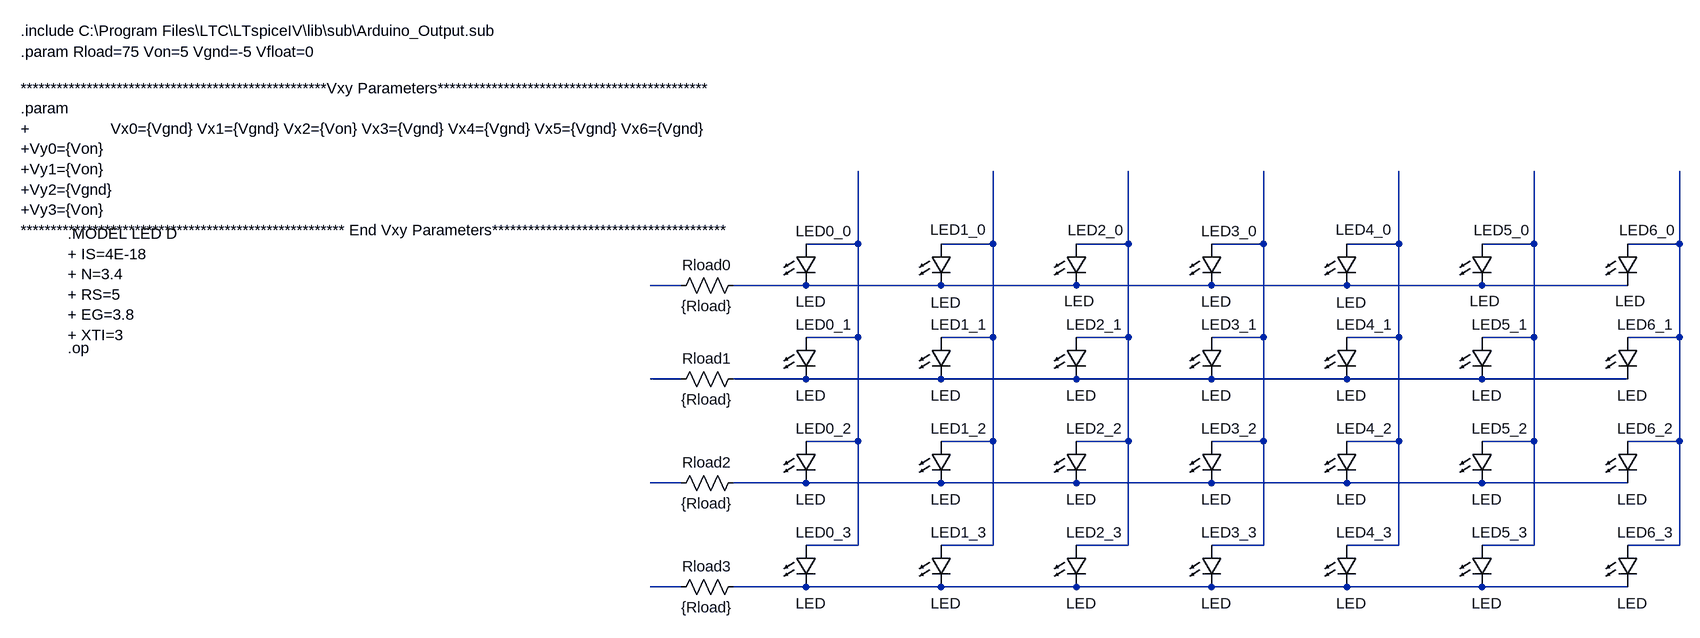
[diagram p0: schematic LED_Array_PCB.asc]
LED_Array_PCB.asc, the LTspice schematic file:
Version 4
SHEET 1 1512 804
WIRE 240 80 240 -32
WIRE 240 80 160 80
WIRE 448 80 448 -32
WIRE 448 80 368 80
WIRE 656 80 656 -32
WIRE 656 80 576 80
WIRE 864 80 864 -32
WIRE 864 80 784 80
WIRE 1072 80 1072 -32
WIRE 1072 80 992 80
WIRE 1280 80 1280 -32
WIRE 1280 80 1200 80
WIRE 1504 80 1504 -32
WIRE 1504 80 1424 80
WIRE -32 144 -80 144
WIRE 160 144 48 144
WIRE 368 144 160 144
WIRE 576 144 368 144
WIRE 784 144 576 144
WIRE 992 144 784 144
WIRE 1200 144 992 144
WIRE 1424 144 1200 144
WIRE 240 224 240 80
WIRE 240 224 160 224
WIRE 448 224 448 80
WIRE 448 224 368 224
WIRE 656 224 656 80
WIRE 656 224 576 224
WIRE 864 224 864 80
WIRE 864 224 784 224
WIRE 1072 224 1072 80
WIRE 1072 224 992 224
WIRE 1280 224 1280 80
WIRE 1280 224 1200 224
WIRE 1504 224 1504 80
WIRE 1504 224 1424 224
WIRE -32 288 -80 288
WIRE 160 288 48 288
WIRE 368 288 160 288
WIRE 576 288 368 288
WIRE 784 288 576 288
WIRE 992 288 784 288
WIRE 1200 288 992 288
WIRE 1424 288 1200 288
WIRE 240 384 240 224
WIRE 240 384 160 384
WIRE 448 384 448 224
WIRE 448 384 368 384
WIRE 656 384 656 224
WIRE 656 384 576 384
WIRE 864 384 864 224
WIRE 864 384 784 384
WIRE 1072 384 1072 224
WIRE 1072 384 992 384
WIRE 1280 384 1280 224
WIRE 1280 384 1200 384
WIRE 1504 384 1504 224
WIRE 1504 384 1424 384
WIRE -32 448 -80 448
WIRE 160 448 48 448
WIRE 368 448 160 448
WIRE 576 448 368 448
WIRE 784 448 576 448
WIRE 992 448 784 448
WIRE 1200 448 992 448
WIRE 1424 448 1200 448
WIRE 240 544 240 384
WIRE 240 544 160 544
WIRE 448 544 448 384
WIRE 448 544 368 544
WIRE 656 544 656 384
WIRE 656 544 576 544
WIRE 864 544 864 384
WIRE 864 544 784 544
WIRE 1072 544 1072 384
WIRE 1072 544 992 544
WIRE 1280 544 1280 384
WIRE 1280 544 1200 544
WIRE 1504 544 1504 384
WIRE 1504 544 1424 544
WIRE -32 608 -80 608
WIRE 160 608 48 608
WIRE 368 608 160 608
WIRE 576 608 368 608
WIRE 784 608 576 608
WIRE 992 608 784 608
WIRE 1200 608 992 608
WIRE 1424 608 1200 608
SYMBOL LED 144 80 R0
WINDOW 0 0 -20 Left 2
WINDOW 3 0 89 Left 2
SYMATTR InstName LED0_0
SYMATTR Value LED
SYMBOL res 64 128 R90
WINDOW 0 0 56 VBottom 2
WINDOW 3 32 56 VTop 2
SYMATTR InstName Rload0
SYMATTR Value {Rload}
SYMBOL res 64 272 R90
WINDOW 0 0 56 VBottom 2
WINDOW 3 32 56 VTop 2
SYMATTR InstName Rload1
SYMATTR Value {Rload}
SYMBOL res 64 432 R90
WINDOW 0 0 56 VBottom 2
WINDOW 3 32 56 VTop 2
SYMATTR InstName Rload2
SYMATTR Value {Rload}
SYMBOL LED 352 80 R0
WINDOW 0 -1 -22 Left 2
WINDOW 3 0 90 Left 2
SYMATTR InstName LED1_0
SYMATTR Value LED
SYMBOL LED 560 80 R0
WINDOW 0 3 -21 Left 2
WINDOW 3 -3 88 Left 2
SYMATTR InstName LED2_0
SYMATTR Value LED
SYMBOL LED 144 224 R0
WINDOW 0 0 -20 Left 2
WINDOW 3 0 89 Left 2
SYMATTR InstName LED0_1
SYMATTR Value LED
SYMBOL LED 352 224 R0
WINDOW 0 0 -20 Left 2
WINDOW 3 0 89 Left 2
SYMATTR InstName LED1_1
SYMATTR Value LED
SYMBOL LED 560 224 R0
WINDOW 0 0 -20 Left 2
WINDOW 3 0 89 Left 2
SYMATTR InstName LED2_1
SYMATTR Value LED
SYMBOL LED 144 384 R0
WINDOW 0 0 -20 Left 2
WINDOW 3 0 89 Left 2
SYMATTR InstName LED0_2
SYMATTR Value LED
SYMBOL LED 352 384 R0
WINDOW 0 0 -20 Left 2
WINDOW 3 0 89 Left 2
SYMATTR InstName LED1_2
SYMATTR Value LED
SYMBOL LED 560 384 R0
WINDOW 0 0 -20 Left 2
WINDOW 3 0 89 Left 2
SYMATTR InstName LED2_2
SYMATTR Value LED
SYMBOL res 64 592 R90
WINDOW 0 0 56 VBottom 2
WINDOW 3 32 56 VTop 2
SYMATTR InstName Rload3
SYMATTR Value {Rload}
SYMBOL LED 144 544 R0
WINDOW 0 0 -20 Left 2
WINDOW 3 0 89 Left 2
SYMATTR InstName LED0_3
SYMATTR Value LED
SYMBOL LED 352 544 R0
WINDOW 0 0 -20 Left 2
WINDOW 3 0 89 Left 2
SYMATTR InstName LED1_3
SYMATTR Value LED
SYMBOL LED 560 544 R0
WINDOW 0 0 -20 Left 2
WINDOW 3 0 89 Left 2
SYMATTR InstName LED2_3
SYMATTR Value LED
SYMBOL LED 768 80 R0
WINDOW 0 0 -20 Left 2
WINDOW 3 0 89 Left 2
SYMATTR InstName LED3_0
SYMATTR Value LED
SYMBOL LED 976 80 R0
WINDOW 0 -1 -22 Left 2
WINDOW 3 0 90 Left 2
SYMATTR InstName LED4_0
SYMATTR Value LED
SYMBOL LED 1184 80 R0
WINDOW 0 3 -21 Left 2
WINDOW 3 -3 88 Left 2
SYMATTR InstName LED5_0
SYMATTR Value LED
SYMBOL LED 768 224 R0
WINDOW 0 0 -20 Left 2
WINDOW 3 0 89 Left 2
SYMATTR InstName LED3_1
SYMATTR Value LED
SYMBOL LED 976 224 R0
WINDOW 0 0 -20 Left 2
WINDOW 3 0 89 Left 2
SYMATTR InstName LED4_1
SYMATTR Value LED
SYMBOL LED 1184 224 R0
WINDOW 0 0 -20 Left 2
WINDOW 3 0 89 Left 2
SYMATTR InstName LED5_1
SYMATTR Value LED
SYMBOL LED 768 384 R0
WINDOW 0 0 -20 Left 2
WINDOW 3 0 89 Left 2
SYMATTR InstName LED3_2
SYMATTR Value LED
SYMBOL LED 976 384 R0
WINDOW 0 0 -20 Left 2
WINDOW 3 0 89 Left 2
SYMATTR InstName LED4_2
SYMATTR Value LED
SYMBOL LED 1184 384 R0
WINDOW 0 0 -20 Left 2
WINDOW 3 0 89 Left 2
SYMATTR InstName LED5_2
SYMATTR Value LED
SYMBOL LED 768 544 R0
WINDOW 0 0 -20 Left 2
WINDOW 3 0 89 Left 2
SYMATTR InstName LED3_3
SYMATTR Value LED
SYMBOL LED 976 544 R0
WINDOW 0 0 -20 Left 2
WINDOW 3 0 89 Left 2
SYMATTR InstName LED4_3
SYMATTR Value LED
SYMBOL LED 1184 544 R0
WINDOW 0 0 -20 Left 2
WINDOW 3 0 89 Left 2
SYMATTR InstName LED5_3
SYMATTR Value LED
SYMBOL LED 1408 80 R0
WINDOW 0 3 -21 Left 2
WINDOW 3 -3 88 Left 2
SYMATTR InstName LED6_0
SYMATTR Value LED
SYMBOL LED 1408 224 R0
WINDOW 0 0 -20 Left 2
WINDOW 3 0 89 Left 2
SYMATTR InstName LED6_1
SYMATTR Value LED
SYMBOL LED 1408 384 R0
WINDOW 0 0 -20 Left 2
WINDOW 3 0 89 Left 2
SYMATTR InstName LED6_2
SYMATTR Value LED
SYMBOL LED 1408 544 R0
WINDOW 0 0 -20 Left 2
WINDOW 3 0 89 Left 2
SYMATTR InstName LED6_3
SYMATTR Value LED
TEXT -1048 -160 Left 2 !***************************************************Vxy Parameters*********************************************\n.param\n+                  Vx0={Vgnd} Vx1={Vgnd} Vx2={Von} Vx3={Vgnd} Vx4={Vgnd} Vx5={Vgnd} Vx6={Vgnd}\n+Vy0={Von}\n+Vy1={Von}\n+Vy2={Vgnd}\n+Vy3={Von}\n****************************************************** End Vxy Parameters***************************************
TEXT -1048 -216 Left 2 !.param Rload=75 Von=5 Vgnd=-5 Vfloat=0
TEXT -976 240 Left 2 !.op
TEXT -1048 -248 Left 2 !.include C:\\Program Files\\LTC\\LTspiceIV\\lib\\sub\\Arduino_Output.sub
TEXT -976 64 Left 2 !.MODEL LED D\n+ IS=4E-18\n+ N=3.4\n+ RS=5\n+ EG=3.8\n+ XTI=3

The netlist it stands for:
* LED_Array_PCB.asc
D§LED0_0 N001 N009 LED
Rload0 N009 N008 {Rload}
Rload1 N011 N010 {Rload}
Rload2 N013 N012 {Rload}
D§LED1_0 N002 N009 LED
D§LED2_0 N003 N009 LED
D§LED0_1 N001 N011 LED
D§LED1_1 N002 N011 LED
D§LED2_1 N003 N011 LED
D§LED0_2 N001 N013 LED
D§LED1_2 N002 N013 LED
D§LED2_2 N003 N013 LED
Rload3 N015 N014 {Rload}
D§LED0_3 N001 N015 LED
D§LED1_3 N002 N015 LED
D§LED2_3 N003 N015 LED
D§LED3_0 N004 N009 LED
D§LED4_0 N005 N009 LED
D§LED5_0 N006 N009 LED
D§LED3_1 N004 N011 LED
D§LED4_1 N005 N011 LED
D§LED5_1 N006 N011 LED
D§LED3_2 N004 N013 LED
D§LED4_2 N005 N013 LED
D§LED5_2 N006 N013 LED
D§LED3_3 N004 N015 LED
D§LED4_3 N005 N015 LED
D§LED5_3 N006 N015 LED
D§LED6_0 N007 N009 LED
D§LED6_1 N007 N011 LED
D§LED6_2 N007 N013 LED
D§LED6_3 N007 N015 LED
.model D D
.lib standard.dio
***************************************************Vxy Parameters*********************************************
.param
+                  Vx0={Vgnd} Vx1={Vgnd} Vx2={Von} Vx3={Vgnd} Vx4={Vgnd} Vx5={Vgnd} Vx6={Vgnd}
+Vy0={Von}
+Vy1={Von}
+Vy2={Vgnd}
+Vy3={Von}
****************************************************** End Vxy Parameters***************************************
.param Rload=75 Von=5 Vgnd=-5 Vfloat=0
.op
.include C:\Program Files\LTC\LTspiceIV\lib\sub\Arduino_Output.sub
.MODEL LED D
+ IS=4E-18
+ N=3.4
+ RS=5
+ EG=3.8
+ XTI=3
.backanno
.end